# EAGLE design prog (EAGLE 7.2.0)
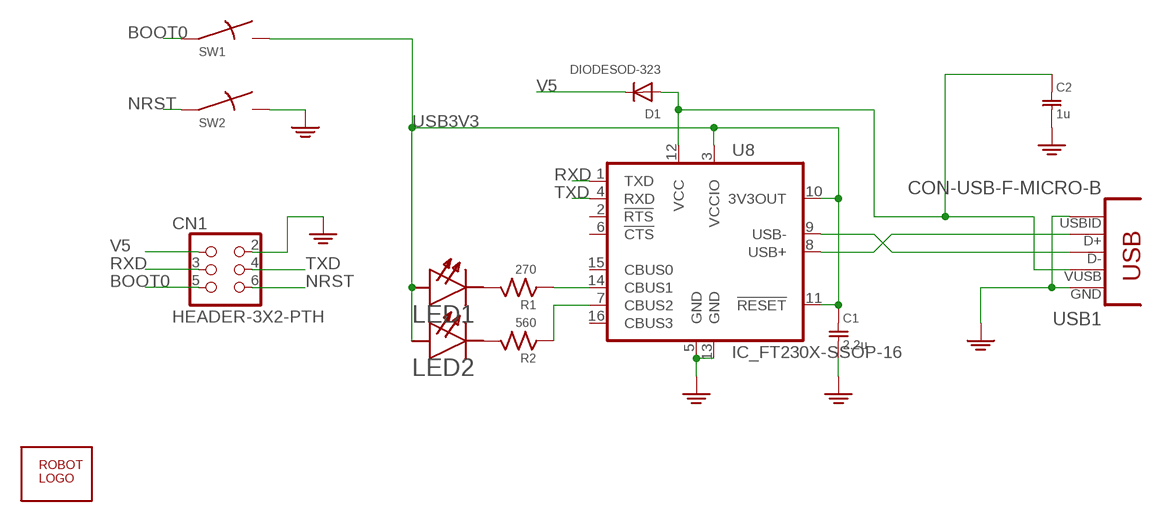
[diagram p0: schematic, sheet 1]

## Parts
C1  2.2u  C0603  [SMD0603]
C2  1u  C0603  [SMD0603]
CN1  HEADER-3X2-PTH  [HEADER-3X2-PTH]
D1  DIODESOD-323  [SOD-323]
LED1  GREEN  LED  [SMD0603D]
LED2  ORANGE  LED  [SMD0603D]
R1  270  R0603  [SMD0603]
R2  560  R0603  [SMD0603]
SW1  SWITCHKMR211  [KMR211]
SW2  SWITCHKMR211  [KMR211]
U8  IC_FT230X-SSOP-16  [SSOP-16-FTDI]
U$1  ROBOTMAN-LOGO  [ROBOTMAN-LOGO]
USB1  CON-USB-F-MICRO-B  [CONN_USB_MICRO-B]

## Nets
BOOT0: CN1.5 SW1.1 SW1.3
GND: C1.2 C2.2 CN1.2 SW2.2 SW2.4 U8.5(GND) U8.13(GND) USB1.P4(USBID) USB1.P5(GND) ; supply symbol labelled PWR-GND
N$21: U8.8(USB+) USB1.P3(D+)
N$22: U8.9(USB-) USB1.P2(D-)
N$23: LED1.C R1.2
N$24: LED2.C R2.2
N$26: R1.1 U8.14(CBUS1)
N$27: R2.1 U8.7(CBUS2)
NRST: CN1.6 SW2.1 SW2.3
RXD: CN1.3 U8.1(TXD)
TXD: CN1.4 U8.4(RXD)
USB3V3: C1.1 LED1.A LED2.A SW1.2 SW1.4 U8.3(VCCIO) U8.10(3V3OUT) U8.11(!RESET)
V5: CN1.1 D1.C
VBUS: C2.1 D1.A U8.12(VCC) USB1.P1(VUSB)
Unconnected: U8.2(!RTS) U8.6(!CTS) U8.15(CBUS0) U8.16(CBUS3) USB1.BODY@1(BODY) USB1.BODY@2(BODY) USB1.BODY@3(BODY) USB1.BODY@4(BODY)

## Library data of the parts
C1 C2 = jaw:C
CN1 = jaw:HEADER-3X2
D1 = jaw:DIODE
LED1 LED2 = jaw:LED
R1 R2 = jaw:R
SW1 SW2 = jaw:SWITCH
U8 = dp_devices:IC_FT230X: BASIC USB to UART IC
U$1 = jaw:ROBOTMAN-LOGO
USB1 = dp_devices:CON-USB-F: USB Female connector

## Board
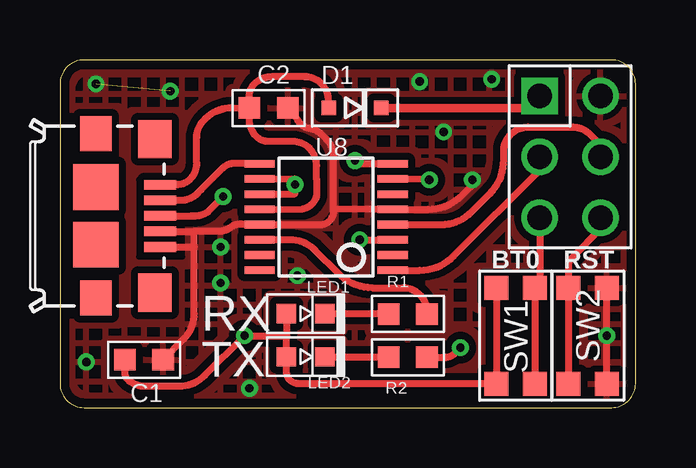
[diagram p1: board, top side]
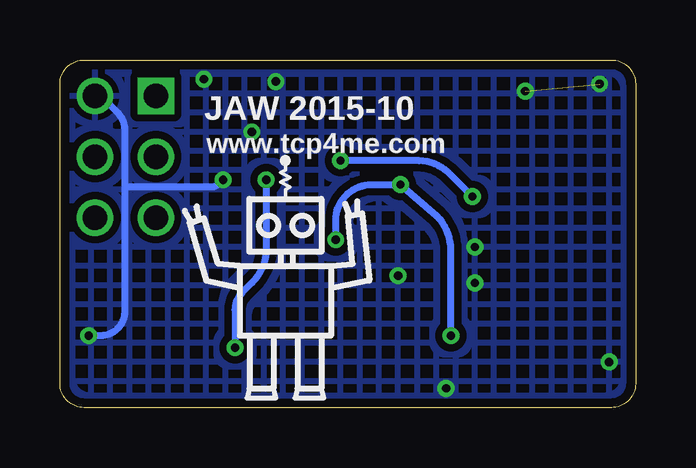
[diagram p2: board, bottom side, seen from below]

Size 24 x 14.5 mm. Coordinates in mm from the lower left corner, seen from the top.
Outline: 1,0 23,0 arc90 24,1 24,13.5 arc90 23,14.5 1,14.5 arc90 0,13.5 0,1 arc90 1,0
Copper layers (1*16): Top 0.0356mm / dielectric 1.5011mm / Bottom 0.0356mm
Design rules "LaenPCBOrder *": minimum track width 6mil, minimum drill 13mil, track to track 6mil, track to pad 6mil, pad to pad 6mil, via to via 6mil, smd to smd 6mil, copper to edge 15mil, drill to drill 6mil, minimum pad ring 10mil, minimum via ring 7mil, stop-mask expansion 4mil, vias tented up to drill 0.5mm, thermal gap 10mil

### Footprints (pad centres in the part's own frame; a part is rotated, then mirrored left to right if it is on the bottom)
SMD0603 = smd 0.9 x 0.9: 1 -0.8,0; 2 0.8,0
HEADER-3X2-PTH = drill 1.016 square: 1 0,0 | drill 1.016: 2 0,2.54; 3 2.54,0; 4 2.54,2.54; 5 5.08,0; 6 5.08,2.54
SOD-323 = smd 0.6 x 0.6: A 1.1,0; C -1.1,0
SMD0603D = smd 0.8 x 0.8: A 0.8,0; C -0.8,0
KMR211 = smd 1 x 1: 1 -2,0.8; 2 -2,-0.8; 3 2,0.8; 4 2,-0.8
SSOP-16-FTDI = smd 0.32 x 1.26: 1 -2.223,-2.779; 2 -1.588,-2.779; 3 -0.953,-2.779; 4 -0.318,-2.779; 5 0.317,-2.779; 6 0.952,-2.779; 7 1.587,-2.779; 8 2.222,-2.779; 9 2.222,2.779; 10 1.587,2.779; 11 0.952,2.779; 12 0.317,2.779; 13 -0.318,2.779; 14 -0.953,2.779; 15 -1.588,2.779; 16 -2.223,2.779
CONN_USB_MICRO-B = smd 1.6 x 1.4: BODY@1 -3.2,2.45; BODY@2 3.2,2.45 | smd 1.45 x 1.3: BODY@3 3.425,0; BODY@6 -3.425,0 | smd 1.9 x 1.9: BODY@4 1.2,0; BODY@5 -1.2,0 | smd 0.4 x 1.35: P1 -1.3,2.675; P2 -0.65,2.675; P3 0,2.675; P4 0.65,2.675; P5 1.3,2.675

### Placement (x,y rotation side)
C1  3.5,2 0 top
C2  8.7,12.5 0 top
CN1  20,13 270 top
D1  12.3,12.5 180 top
LED1  10.24,3.92 180 top
LED2  10.24,2.12 180 top
R1  14.5,3.9 180 top
R2  14.5,2.1 180 top
SW1  19,3 270 top
SW2  22,3 90 top
U8  11.1,7.95 90 top
U$1  14.6,4.7 0 bottom
USB1  1.5,8 270 top

### Tracks (layer width: path | path; a pad name or v marks a point on that pad's centre or on a via)
BOOT0
  Top 0.3: CN1.5 20,5.2 SW1.1 SW1.3
GND  (via drill 0.35)  (1 unrouted)
  Top 0.3: 11.4,8.28 U8.5 15.35,8.27 arc45 16.76,8.85 17.2,9.29 v17.2,9.5 | 11.4,8.28 arc-90 10.96,7.64 U8.13 7.64,7.64 arc45 7.16,7.54 arc-45 6.55,7.35 5.6,7.35 | USB1.P4 5.6,7.35 | USB1.P5 5.6,6.7 | C1.2 5.16,2.86 arc45 5.6,3.92 5.6,6.7 | 11.4,8.28 11.4,10.59 arc45 11.11,11.19 10.9,11.4 arc45 10.35,11.65 arc-45 9.92,11.98 C2.2 | 5.6,6.7 5.6,7.35 | SW2.2 SW2.4
  Bottom 0.3: CN1.2 22.3,13 21.59,12.29 arc45 21.3,11.59 21.3,9.2 | 21.3,9.2 21.3,4 arc90 22.3,3 v22.8,3 | v17.2,9.5 17.35,9.35 arc45 17.71,9.2 21.3,9.2
  other vias: 1.5,13.5 1.1,1.9 7.9,0.8 6.7,5.2 4.6,13.2 15,13.6 9.9,5.5 18,13.7 6.7,6.7 16,11.5
  pour Top (isolate 0.3, hatched): -0.5,15 24.5,15 24.5,-0.5 -0.5,-0.5
  pour Bottom (isolate 0.3, hatched): -0.5,15 24.5,15 24.5,-0.5 -0.5,-0.5
N$3
  cutout Top: 3.3,9.5 3.3,6.3 5.1,6.3 5.1,9.5
N$21  (via drill 0.35)
  Top 0.3: v6.8,8.8 6.19,8.19 arc-45 5.49,8 USB1.P3 | v12.3,10.3 12.28,10.18 U8.8
  Bottom 0.3: v6.8,8.8 7.71,9.71 arc-45 9.03,10.3 v12.3,10.3
N$22
  Top 0.3: U8.9 7.25,10.18 arc45 6.79,9.99 5.89,9.09 5.74,8.94 arc-45 5.04,8.65 USB1.P2
N$23
  Top 0.3: LED1.C 13.65,3.92 arc-45 R1.2
N$24
  Top 0.3: LED2.C 13.65,2.12 arc-45 R2.2
N$26
  Top 0.3: U8.14 8.35,7 9.58,7 arc-45 10.64,6.56 11.61,5.59 arc45 13.03,5 14.3,5 arc-90 15.3,4 R1.1
N$27  (via drill 0.35)
  Top 0.3: U8.7 15.35,9.55 v15.4,9.5 | R2.1 16.09,2.1 arc45 16.45,2.25 v16.7,2.5
  Bottom 0.3: v15.4,9.5 15.4,6.63 arc45 15.99,5.21 16.41,4.79 arc-45 16.7,4.09 v16.7,2.5
NRST
  Top 0.3: CN1.6 22.54,7.44 21.35,6.25 arc45 21.2,5.89 SW2.3 SW2.1
RXD
  Top 0.3: U8.1 15,5.73 arc45 16.41,6.31 20,9.9 CN1.3
TXD
  Top 0.3: U8.4 15.9,7.63 arc45 17.15,8.15 17.91,8.91 arc45 18.5,10.33 18.5,10.69 arc-45 18.79,11.39 18.81,11.41 arc-45 19.51,11.7 21.39,11.7 arc-45 22.09,11.41 22.5,11 22.5,10.5 CN1.4
USB3V3  (via drill 0.35)
  Top 0.3: U8.10 9.8,9.55 v9.8,9.3 9.79,8.91 U8.11 | v12.5,7 13.89,7 U8.3 | 9.44,3 v7.7,3 6.04,1.34 arc-45 4.98,0.9 3.51,0.9 arc-45 2.81,1.19 arc-45 2.7,1.45 C1.1 | LED2.A 9.44,3 | LED1.A 9.44,3 | SW1.2 SW1.4 9.94,1 arc-90 9.44,1.5 LED2.A | 9.4,2.08 LED2.A
  Bottom 0.3: v12.5,7 12.5,7.8 arc90 11,9.3 10,9.3 v9.8,9.3 8.29,7.99 arc45 7.7,6.57 v7.7,3
V5
  Top 0.35: D1.C 19.5,12.5 CN1.1
VBUS
  Top 0.3: C2.1 7.15,12.5 arc45 6.08,12.07 5.99,11.98 arc45 5.7,11.27 5.7,10.21 arc-45 5.41,9.51 arc-45 4.91,9.3 USB1.P1 | C2.1 7.89,12.98 arc-46 8.11,13.51 arc-45 8.81,13.8 10.2,13.8 arc-90 11.2,12.8 D1.A | U8.12 10.09,8.28 arc90 10.7,9.08 10.7,9.51 10.7,10.09 10.7,10.1 arc90 9.7,11.1 9.69,11.1 8.69,11.1 arc-45 8.19,11.31 arc-45 7.9,12.01 C2.1

### Text on the board
tPlace: BT0 | RST | RX | TX
bPlace: JAW 2015-10 | www.tcp4me.com